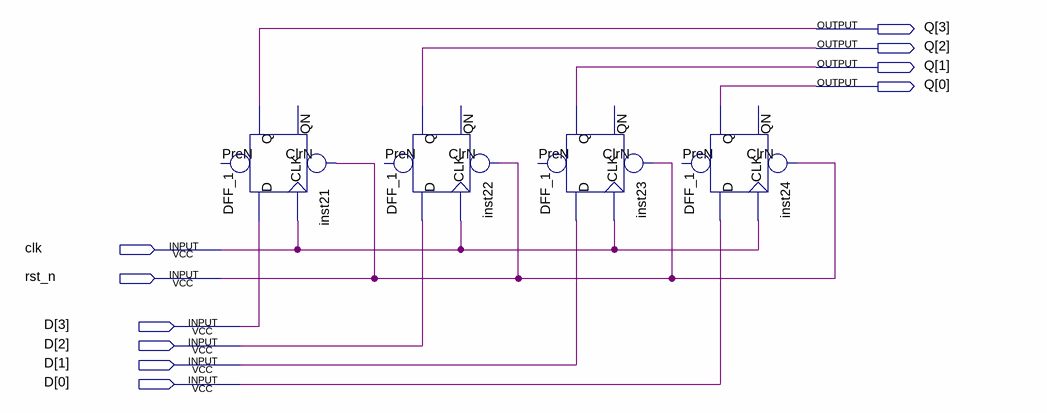
[diagram p0: schematic sheet]
// Quartus schematic DataReg.bdf as structural Verilog: 4 symbols, 10 pins
module DataReg (
  input  clk,
  input  rst_n,
  input  [3:0] D,
  output [3:0] Q
);

  DFF_1 inst21 (.CLK(clk), .D(D[3]), .ClrN(rst_n), .Q(Q[3]));  // open: PreN, QN
  DFF_1 inst22 (.CLK(clk), .D(D[2]), .ClrN(rst_n), .Q(Q[2]));  // open: PreN, QN
  DFF_1 inst23 (.CLK(clk), .D(D[1]), .ClrN(rst_n), .Q(Q[1]));  // open: PreN, QN
  DFF_1 inst24 (.CLK(clk), .D(D[0]), .ClrN(rst_n), .Q(Q[0]));  // open: PreN, QN
endmodule
